# Altium schematic sheet coil_if.SchDoc: =ProjectName+'_'+Revision+'_'+VariantName
size A3; Date: [Sheet Date]; Author: [Sheet Author]; DocumentNumber: 3; Revision: 0; SheetNumber: 3; SheetTotal: 5
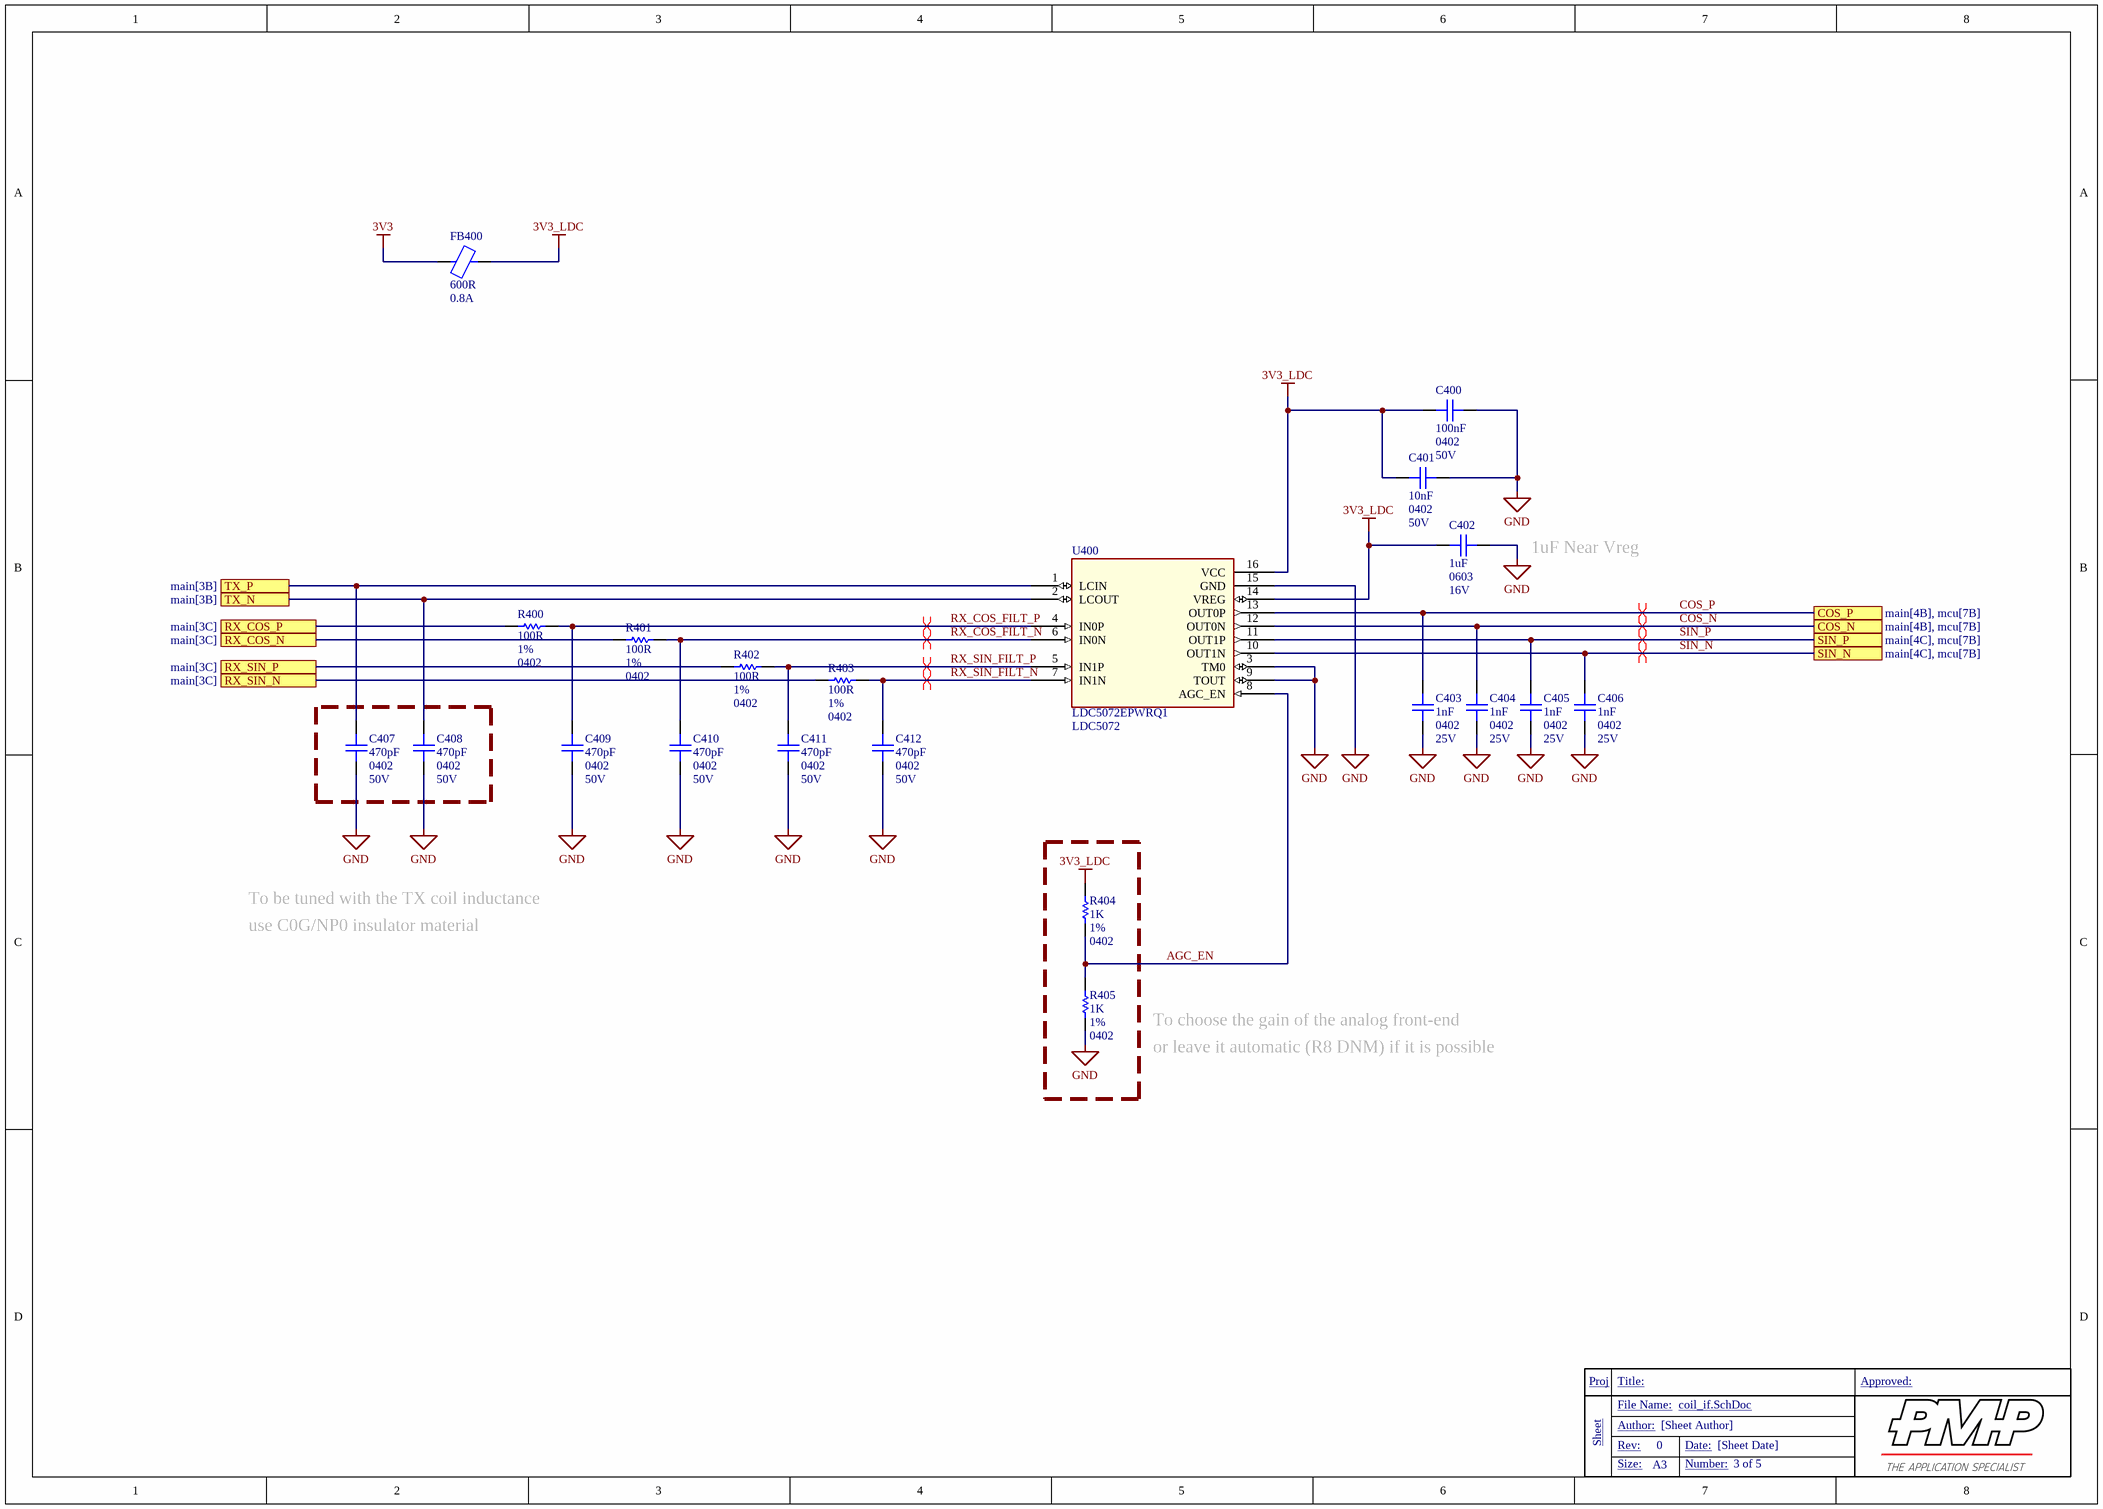
[diagram p0: coil_if.SchDoc]

## Parts
C400  Case/Package: 0402  Op Voltage: 50V  [CER0402]  (hidden comment: 100nF)
C401  Case/Package: 0402  Op Voltage: 50V  [CER0402]  (hidden comment: 10nF)
C402  Case/Package: 0603  Op Voltage: 16V  [CER0603]  (hidden comment: 1uF)
C403  Case/Package: 0402  Op Voltage: 25V  [CER0402]  (hidden comment: 1nF)
C404  Case/Package: 0402  Op Voltage: 25V  [CER0402]  (hidden comment: 1nF)
C405  Case/Package: 0402  Op Voltage: 25V  [CER0402]  (hidden comment: 1nF)
C406  Case/Package: 0402  Op Voltage: 25V  [CER0402]  (hidden comment: 1nF)
C407  Case/Package: 0402  Op Voltage: 50V  [CER0402]  (hidden comment: 470pF)
C408  Case/Package: 0402  Op Voltage: 50V  [CER0402]  (hidden comment: 470pF)
C409  Case/Package: 0402  Op Voltage: 50V  [CER0402]  (hidden comment: 470pF)
C410  Case/Package: 0402  Op Voltage: 50V  [CER0402]  (hidden comment: 470pF)
C411  Case/Package: 0402  Op Voltage: 50V  [CER0402]  (hidden comment: 470pF)
C412  Case/Package: 0402  Op Voltage: 50V  [CER0402]  (hidden comment: 470pF)
FB400  Impedence @100MHz: 600R  Rated Current @85°C: 0.8A  [FEB0603]
R400  value 100R  Tolerance: 1%  Case/Package: 0402  [Res0402]  (hidden comment: SMD Resistor)
R401  value 100R  Tolerance: 1%  Case/Package: 0402  [Res0402]  (hidden comment: SMD Resistor)
R402  value 100R  Tolerance: 1%  Case/Package: 0402  [Res0402]  (hidden comment: SMD Resistor)
R403  value 100R  Tolerance: 1%  Case/Package: 0402  [Res0402]  (hidden comment: SMD Resistor)
R404  value 1K  Tolerance: 1%  Case/Package: 0402  [Res0402]  (hidden comment: SMD Resistor)
R405  value 1K  Tolerance: 1%  Case/Package: 0402  [Res0402]  (hidden comment: SMD Resistor)
U400  LDC5072EPWRQ1  value LDC5072  [TSSOP16-PW_TEX]

## Ports
COS_N (see main[4B], mcu[7B]), COS_P (see main[4B], mcu[7B]), RX_COS_N (see main[3C]), RX_COS_P (see main[3C]), RX_SIN_N (see main[3C]), RX_SIN_P (see main[3C]), SIN_N (see main[4C], mcu[7B]), SIN_P (see main[4C], mcu[7B]), TX_N (see main[3B]), TX_P (see main[3B])

## Nets
3V3: FB400.1
3V3_LDC: C400.1 C401.1 C402.1 FB400.2 R404.2 U400.14(VREG) U400.16(VCC)
GND: C400.2 C401.2 C402.2 C403.2 C404.2 C405.2 C406.2 C407.2 C408.2 C409.2 C410.2 C411.2 C412.2 R405.1 U400.3(TM0) U400.9(TOUT) U400.15(GND)
AGC_EN: R404.1 R405.2 U400.8(AGC_EN)
COS_N: C404.1 U400.12(OUT0N) ; port COS_N
COS_P: C403.1 U400.13(OUT0P) ; port COS_P
RX_COS_FILT_N: C410.1 R401.2 U400.6(IN0N)
RX_COS_FILT_P: C409.1 R400.2 U400.4(IN0P)
RX_COS_N: R401.1 ; port RX_COS_N
RX_COS_P: R400.1 ; port RX_COS_P
RX_SIN_FILT_N: C412.1 R403.2 U400.7(IN1N)
RX_SIN_FILT_P: C411.1 R402.2 U400.5(IN1P)
RX_SIN_N: R403.1 ; port RX_SIN_N
RX_SIN_P: R402.1 ; port RX_SIN_P
SIN_N: C406.1 U400.10(OUT1N) ; port SIN_N
SIN_P: C405.1 U400.11(OUT1P) ; port SIN_P
TX_N: C408.1 U400.2(LCOUT) ; port TX_N
TX_P: C407.1 U400.1(LCIN) ; port TX_P

## Layout directives
differential pair: COS_N, COS_P, RX_COS_FILT_N, RX_COS_FILT_P, RX_SIN_FILT_N, RX_SIN_FILT_P, SIN_N, SIN_P

## Notes on the sheet
- 1uF Near Vreg
- To be tuned with the TX coil inductance
- use C0G/NP0 insulator material
- To choose the gain of the analog front-end
- or leave it automatic (R8 DNM) if it is possible
- Proj
- Title:
- Approved:
- Sheet
- File Name:
- Rev:
- Author:
- Date:
- Size:
- A3
- Number:

## Library data of the parts
C400 = GCM155R71H104KE02D: MLCC Automotive, 100nF, 0402, 50V, 10%, X7r; MFG1: MURATA; Min Op# Temp °C: -55; Max Op# temp °C: 125; Qualification: AEC-Q200; MPN1: GCM155R71H104KE02D; Value: 100nF; MFG2: MURATA; MPN2: GCM155R71H104KE37; Tolerance: 10%; Dielectric: X7R; Supplier: Mouser; Supplier Part Number: 81-GCM155R71H104KE2D; Supplier URL: https://www.mouser.it/ProductDetail/Murata-Electronics/GCM155R71H104KE02D?qs=hNud%2FORuBR2sLZsqfoz4Fw%3D%3D; Datasheet URL: https://www.mouser.it/datasheet/2/281/1/GCM155R71H104KE02_01A-3142168.pdf; Technology: Powertrain/Safety for Automotive
C401 = GCM155R71H103KA55*: MLCC Automotive, 10nF, 0402, 25V, 10%, X7r; MFG1: MURATA; Min Op# Temp °C: -55; Max Op# temp °C: 125; Qualification: AEC-Q200; MPN1: GCM155R71H103KA55*; Value: 10nF; Tolerance: 10%; Dielectric: X7R; Supplier: Mouser; Supplier Part Number: 81-GCM155R71H103KA5J; Supplier URL: https://www.mouser.it/ProductDetail/Murata-Electronics/GCM155R71H103KA55J?qs=N3Kl9KD794RolAwdnyzU1Q%3D%3D; Datasheet URL: https://www.mouser.it/datasheet/2/281/1/GCM155R71H103KA55_01A-3142380.pdf; Technology: Powertrain/Safety for Automotive
C402 = GCM188R71C105KA64J: MLCC Automotive, 1uF, 0603, 16V, 10%, X7R; MFG1: MURATA; Min Op# Temp °C: -55; Max Op# temp °C: 125; Qualification: AEC-Q200; MPN1: GCM188R71C105KA64J; Value: 1uF; MFG2: KEMET; MPN2: C0603C105K4RACAUTO; Tolerance: 10%; Dielectric: X7R; Supplier: Mouser; Supplier Part Number: 81-GCM188R71C105KA4J; Supplier URL: https://www.mouser.it/ProductDetail/Murata-Electronics/GCM188R71C105KA64J?qs=4%252BGqC78dy0BN5WaW5TLgXw%3D%3D; Datasheet URL: https://www.mouser.it/datasheet/2/281/1/GCM188R71C105KA64_04A-3143889.pdf; Technology: Powertrain/Safety for Automotive
C403-C406 = GRT1555C1E102JA02J: MLCC Automotive, 1nF, 0402, 25V, 10%, COG; MFG1: MURATA; Tolerance: 5%; Dielectric: C0G; Min Op# Temp °C: -55; Max Op# temp °C: 125; Qualification: AEC-Q200; MPN1: GRT1555C1E102JA02J; Value: 1nF; Supplier: Mouser; Supplier Part Number: 81-GRT1555C1E102JA2J; Supplier URL: https://www.mouser.it/it/ProductDetail/Murata-Electronics/GRT1555C1E102JA02J?qs=sGAEpiMZZMvsSlwiRhF8qtsGU%2FCnaNeQokeRzBpVly3nnJVQ2ndM9w%3D%3D; Datasheet URL: https://www.mouser.it/datasheet/3/76/4/GRT1555C1E102JA02_01A.pdf
C407-C412 = GCM1555C1H471JA16: MLCC Automotive, 470pF, 0402, 50V, 5%, COG; MFG1: MURATA; Min Op# Temp °C: -55; Max Op# temp °C: 125; Qualification: AEC-Q200; MPN1: GCM1555C1H471JA16; Value: 470pF; Tolerance: 5%; Dielectric: COG; Supplier: Mouser; Supplier Part Number: 81-GCM1555C1H471JA6J; Supplier URL: https://www.mouser.it/ProductDetail/Murata-Electronics/GCM1555C1H471JA16J?qs=N3Kl9KD794TXvw4%2Fs7azFA%3D%3D; Technology: Powertrain/Safety for Automotive
FB400 = BLM18HE601SH1D: SMD EMI Suppression Ferrite Bead 600R, 0603, For DC Power; MFG1: MURATA; Rated Current @125°C: 0.6A; DCR (mR): 125; Min Op# Temp °C: -55; MPN1: BLM18HE601SH1D; Impedence @1GHz: 600R; Case/Package: 0603; Supplier: Mouser; Supplier Part Number: 81-BLM18HE601SH1D; Supplier URL: https://www.mouser.it/ProductDetail/Murata-Electronics/BLM18HE601SH1D?qs=d0WKAl%252BL4KZJDOgHon8ecQ%3D%3D; Datasheet URL: https://www.murata.com/products/productdata/8796199452702/QNFA9104.pdf?1539737628000; Max Op# temp °C: 125; Technology: AEC-Q200
R400-R403 = CRCW0402100RFKED: Thick Film SM Chip Resistors, 100R, 0402, ±1%, 1/16W; MFG1: VISHAY; Power: 63mW; Temp# Coeffiient (PPM/C): 100; Min Op# Temp °C: -55; Max Op# temp °C: 155; Qualification: AEC-Q200; MPN1: CRCW0402100RFKED; Supplier: Mouser; Supplier Part Number: 71-CRCW0402-100-E3; Supplier URL: https://www.mouser.it/ProductDetail/Vishay-Dale/CRCW0402100RFKED?qs=OlqPY1CiralT1EG%2F62gJpQ%3D%3D; Datasheet URL: https://www.vishay.com/docs/20035/dcrcwe3.pdf; Technology: Thick Film
R404 R405 = CRCW04021K00FKED: Thick Film SM Chip Resistors, 1K, 0402, ±1%, 1/16W; MFG1: VISHAY; Power: 63mW; Temp# Coeffiient (PPM/C): 100; Min Op# Temp °C: -55; Max Op# temp °C: 155; Qualification: AEC-Q200; MPN1: CRCW04021K00FKED; Supplier: Mouser; Supplier Part Number: 71-CRCW0402-1.0K-E3; Supplier URL: https://www.mouser.it/ProductDetail/Vishay-Dale/CRCW04021K00FKED?qs=YX%252BK5oaHNYqQ2WK%252BIAW12A%3D%3D; Technology: Thick Film
U400 = LDC5072EPWRQ1: IPS interface IC; Manufacturer_Name: Texas Instruments; MFG1: TI; Min Op# Temp °C: -40; Max Op# temp °C: 160; Qualification: AEC-Q100; Type: Specialized Sensors; Copyright: Copyright (C) 2026 Ultra Librarian. All rights reserved.; Manufacturer_Part_Number: LDC5072EPWRQ1; RefDes: RefDes; MPN1: LDC5072EPWRQ1; Case/Package: TSSOP-16; Supplier: Mouser; Supplier Part Number: 595-LDC5072EPWRQ1; Supplier URL: https://www.mouser.it/it/ProductDetail/Texas-Instruments/LDC5072EPWRQ1?qs=GBLSl2AkiruyHDEJhswGzQ%3D%3D; Datasheet URL: https://www.ti.com/lit/ds/symlink/ldc5072-q1.pdf?ts=1784869376494&ref_url=https%253A%252F%252Fwww.ti.com%252Fproduct%252FLDC5072-Q1